# Altium project PreCharge.PrjPcb (part 4 of 4)

## Sheet Motor Interface - Pre-Charge Logic.SchDoc: Motor Interface - PreCharge Logic
size B; Organization: Midnight Sun Solar Rayce Car Team; Address1: University of Waterloo; Address2: 200 University Ave W; Address3: Waterloo, ON, Canada; Address4: N2L 3E9; DocumentNumber: 6; SheetNumber: 6; SheetTotal: 6; Website: www.uwmidsun.com; ProjectName: ProjectName
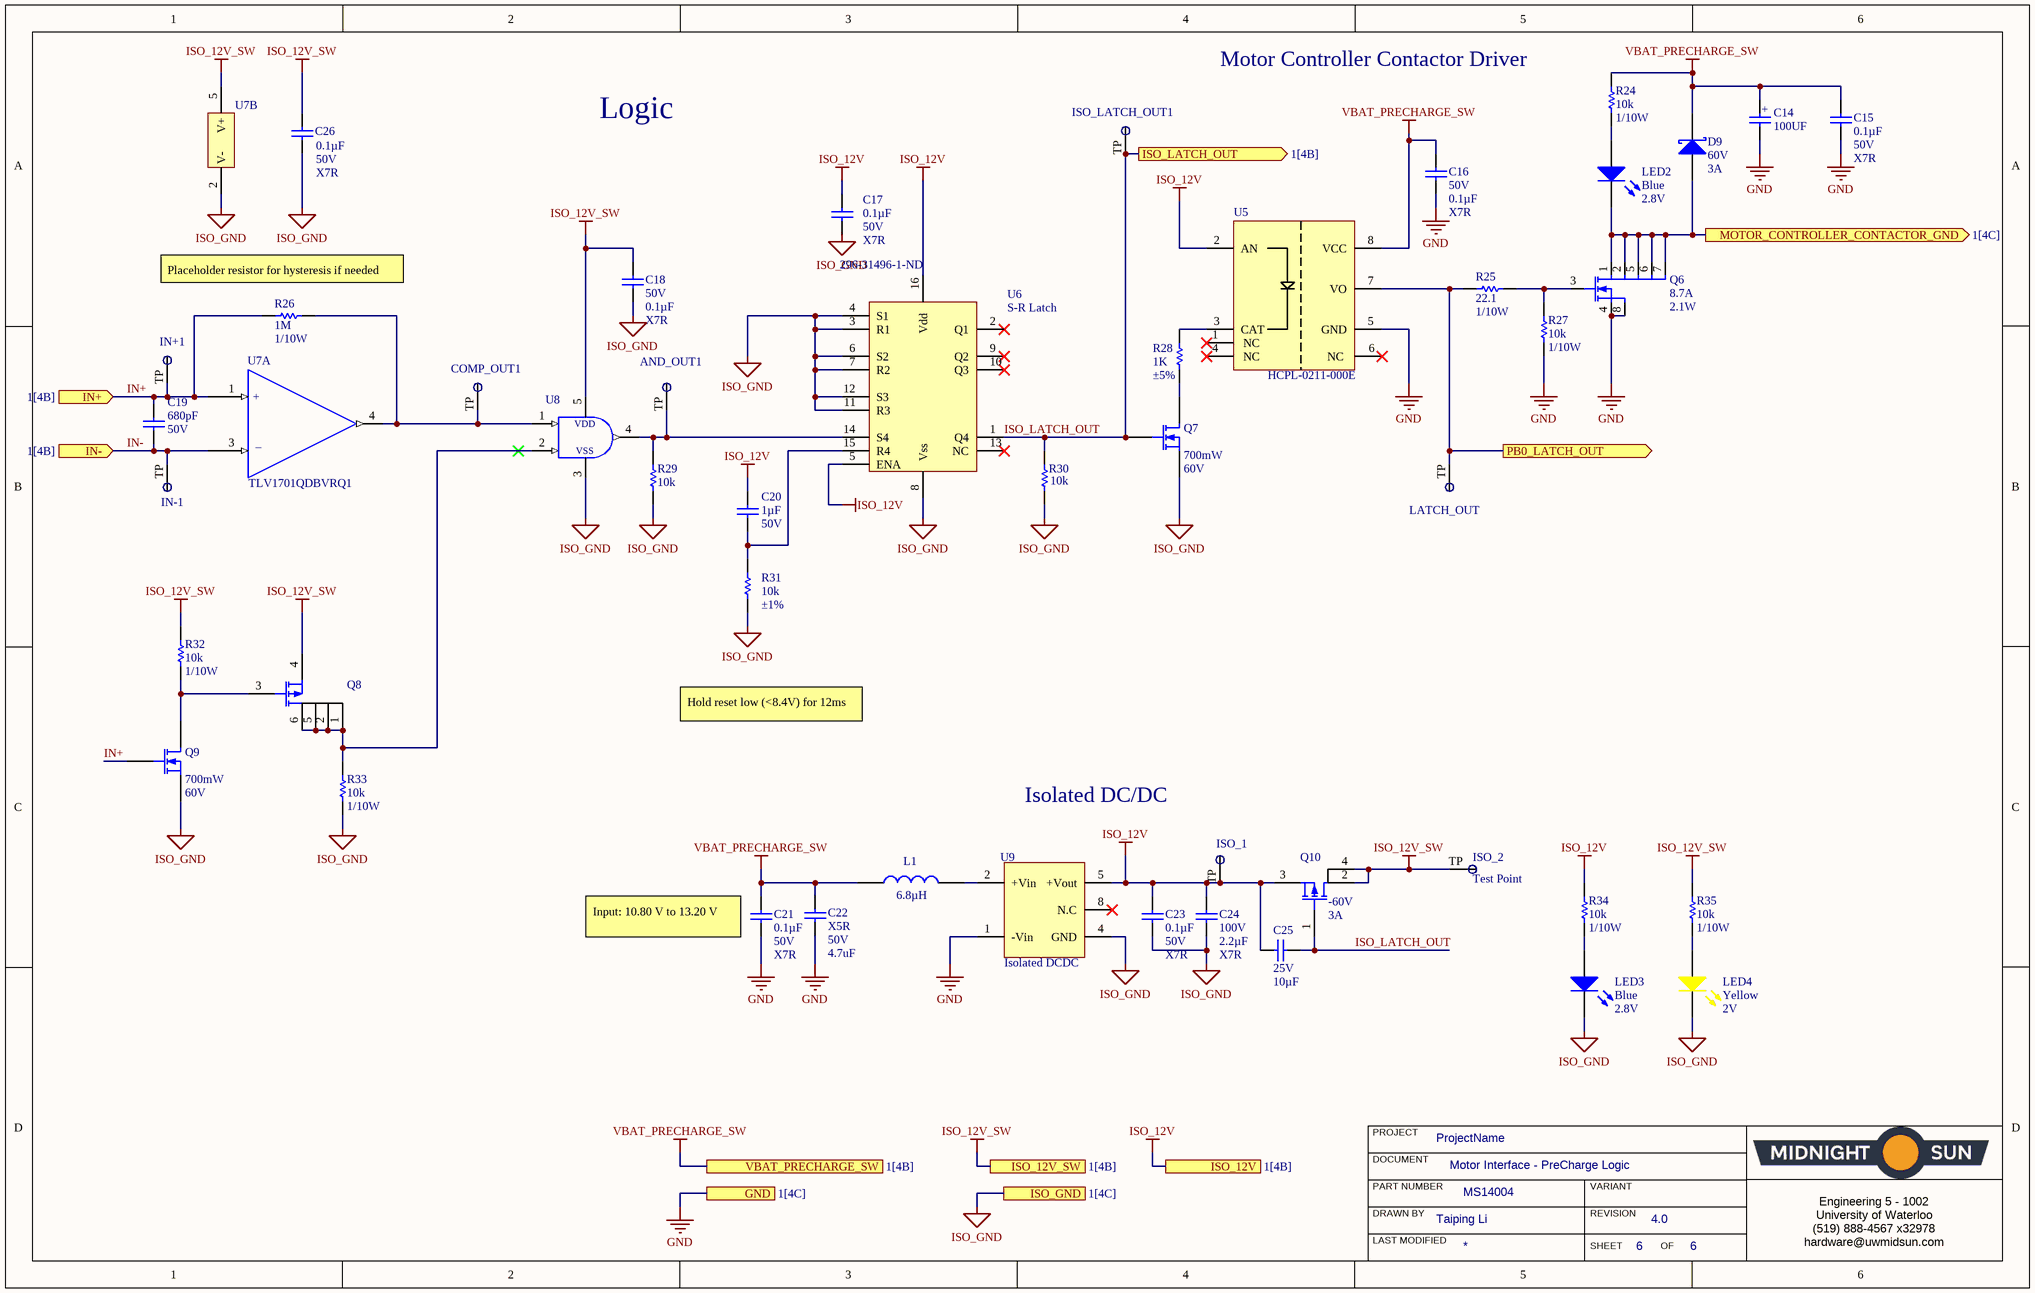
[diagram p5: Motor Interface - Pre-Charge Logic.SchDoc]

### Parts
AND_OUT1  Test Point  [Test Point]  (value not drawn)  (no BOM)
C14  100UF  [CAP ALUM 6.3MM RADIAL SMD]
C15  Capacitance: 0.1µF  Voltage: 50V  Temperature Coefficient: X7R  [CAP, 0603]  (hidden comment: CAP CER 0.1UF 50V 10% X7R 0603)
C16  Voltage: 50V  Capacitance: 0.1µF  Temperature Coefficient: X7R  [CAP, 0603]  (hidden comment: CAP CER 0.1UF 50V 10% X7R 0603)
C17  Voltage: 50V  Capacitance: 0.1µF  Temperature Coefficient: X7R  [CAP, 0603]  (hidden comment: CAP CER 0.1UF 50V 10% X7R 0603)
C18  Voltage: 50V  Capacitance: 0.1µF  Temperature Coefficient: X7R  [CAP, 0603]  (hidden comment: CAP CER 0.1UF 50V 10% X7R 0603)
C19  Voltage: 50V  Capacitance: 680pF  [CAP, 0603]  (hidden comment: CAP CER 680PF 50V C0G/NP0 0603)
C20  Voltage: 50V  Capacitance: 1µF  [CAP, 0603]  (hidden comment: CAP CER 1UF 50V 10% X7R 0603)
C21  Capacitance: 0.1µF  Voltage: 50V  Temperature Coefficient: X7R  [CAP, 0603]  (hidden comment: CAP CER 0.1UF 50V 10% X7R 0603)
C22  value 4.7uF  Temperature Coefficient: X5R  Voltage - Rated: 50V  [CAP, 0805]  (hidden comment: CAP CER 4.7UF 50V 10% X5R 0805)
C23  Capacitance: 0.1µF  Voltage: 50V  Temperature Coefficient: X7R  [CAP, 0603]  (hidden comment: CAP CER 0.1UF 50V 10% X7R 0603)
C24  Voltage: 100V  Capacitance: 2.2µF  Temperature Coefficient: X7R  [CAP, 1206]  (hidden comment: CAP CER 2.2UF 100V ±20% X7R 1206)
C25  Voltage - Rated: 25V  Capacitance: 10µF  [CAP, 0805]  (hidden comment: CAP CER 10uF 25V 10% X5R 0805)
C26  Voltage: 50V  Capacitance: 0.1µF  Temperature Coefficient: X7R  [CAP, 0603]  (hidden comment: CAP CER 0.1UF 50V 10% X7R 0603)
COMP_OUT1  Test Point  [Test Point]  (value not drawn)  (no BOM)
D9  Voltage - DC Reverse (Vr) (Max): 60V  Current - Average Rectified (Io): 3A  [Diode, SMA]  (hidden comment: DIODE SCHOTTKY 60V 3A SMA)
IN+1  Test Point  [Test Point]  (value not drawn)  (no BOM)
IN-1  Test Point  [Test Point]  (value not drawn)  (no BOM)
ISO_1  Test Point  [Test Point]  (value not drawn)  (no BOM)
ISO_2  Test Point  [Test Point]  (no BOM)
ISO_LATCH_OUT1  Test Point  [Test Point]  (value not drawn)  (no BOM)
L1  Inductance: 6.8µH  [NLFV32T-6R8M-EF/IND 6.8uH]  (hidden comment: IND 6.8uH 260mA 20% 1210)
LATCH_OUT  Test Point  [Test Point]  (value not drawn)  (no BOM)
LED2  Color: Blue  Voltage - Forward (Vf) (Typ): 2.8V  [LED_0603]  (hidden comment: LED BLUE CLEAR 2.8V 0603)
LED3  Color: Blue  Voltage - Forward (Vf) (Typ): 2.8V  [LED_0603]  (hidden comment: LED BLUE CLEAR 2.8V 0603)
LED4  Color: Yellow  Voltage - Forward (Vf) (Typ): 2V  [LED_0603]  (hidden comment: LED YELLOW CLEAR 2.1V 0603)
Q6  Current - Continuous Drain (Id) @ 25°C: 8.7A  Power Dissipation (Max): 2.1W  [MOSFET N-CH 30V 12A 2mmx2mm PQFN]  (hidden comment: MOSFET N-CH 30V 8.7A 2.1W 6-PQFN (2x2))
Q7  Max Power Dissipation: 700mW  Drain to Source Voltage (Vdss): 60V  [SOT23]  (hidden comment: MOSFET N-CH 60V 310MA SOT23)
Q8  MOSFET P-CH 30V 4A 1.6W SOT-23-6  [P-MOSFET]  (value not drawn)
Q9  Max Power Dissipation: 700mW  Drain to Source Voltage (Vdss): 60V  [SOT23]  (hidden comment: MOSFET N-CH 60V 310MA SOT23)
Q10  Continuous Drain Current (ID): 3A  Drain to Source Breakdown Voltage: -60V  [SOT223_N]  (hidden comment: P-Channel)
R24  Resistance: 10k  Power: 1/10W  [RES, 0603]  (hidden comment: RES 10K OHM 1% 1/10W 0603)
R25  Resistance: 22.1  Power: 1/10W  [RES, 0603]  (hidden comment: RES 22.1 OHM 1% 1/10W 0603)
R26  Resistance (Ohms): 1M  Power (Watts): 1/10W  [RES, 0603]  (hidden comment: RES 1M OHM 1% 1/10W 0603)
R27  Resistance: 10k  Power: 1/10W  [RES, 0603]  (hidden comment: RES 10K OHM 1% 1/10W 0603)
R28  1K  Tolerance: ±5%  [RES, 0603]
R29  Resistance: 10k  [RES, 0603]  (hidden comment: RES 10K OHM 1% 1/10W 0603)
R30  Resistance: 10k  [RES, 0603]  (hidden comment: RES 10K OHM 1% 1/10W 0603)
R31  Tolerance: ±1%  Resistance: 10k  [RES, 0603]  (hidden comment: RES 10K OHM 1% 1/10W 0603)
R32  Resistance: 10k  Power: 1/10W  [RES, 0603]  (hidden comment: RES 10K OHM 1% 1/10W 0603)
R33  Resistance: 10k  Power: 1/10W  [RES, 0603]  (hidden comment: RES 10K OHM 1% 1/10W 0603)
R34  Resistance: 10k  Power: 1/10W  [RES, 0603]  (hidden comment: RES 10K OHM 1% 1/10W 0603)
R35  Resistance: 10k  Power: 1/10W  [RES, 0603]  (hidden comment: RES 10K OHM 1% 1/10W 0603)
U5  Manufacturer Part Number: HCPL-0211-000E  [IC OPTOISOLATOR HCPL-0211 SO-8]  (hidden comment: IC OPTOISOLATOR 3.75KV PUSH PULL 8-SOIC)
U6  Supplier Part Number 1: 296-31496-1-ND  Logic Type: S-R Latch  [IC, SR Latch, CD4043BDR]  (hidden comment: IC SR LATCH 4CH 16SOIC)
U7  Manufacturer Part Number: TLV1701QDBVRQ1  [SOT95P280X145-5N]  (hidden comment: IC COMPARATOR TLV1701 SOT-23-5)  (parts A,B of 2)
U8  IC AND GATE 1CH 5-SSOP  [IC, 2-Input AND Gate]  (value not drawn)
U9  Type: Isolated DCDC  [IC, Isolated DCDC]  (hidden comment: IC DCDC ISOLATED 12V 1W 8-SMD 5-LEAD)

### Ports
GND (see 1[4C]), IN+ (in, see 1[4B]), IN- (in, see 1[4B]), ISO_12V (see 1[4B]), ISO_12V_SW (see 1[4B]), ISO_GND (see 1[4C]), ISO_LATCH_OUT (out, see 1[4B]), MOTOR_CONTROLLER_CONTACTOR_GND (out, see 1[4C]), PB0_LATCH_OUT (out), VBAT_PRECHARGE_SW (see 1[4B])

### Nets
GND: C14.2 C15.2 C16.2 C21.2 C22.1 Q6.4(S) Q6.8(S) R27.2 U5.5(GND) U9.1(-Vin) ; port GND
ISO_12V: C17.2 C20.1 C23.1 C24.2 C25.1 ISO_1.TP Q10.3(S) R34.2 U5.2(AN) U6.5(ENA) U6.16(Vdd) U9.5(+Vout) ; port ISO_12V
ISO_12V_SW: C18.2 C26.2 ISO_2.TP Q8.4(S) Q10.2(D) Q10.4(D) R32.1 R35.2 U7.5(V+) U8.5(VCC) ; port ISO_12V_SW
ISO_GND: C17.1 C18.1 C23.2 C24.1 C26.1 LED3.2(K) LED4.2(K) Q7.2(S) Q9.2(S) R29.1 R30.1 R31.2 R33.2 U6.3(R1) U6.4(S1) U6.6(S2) U6.7(R2) U6.8(Vss) U6.11(R3) U6.12(S3) U7.2(V-) U8.3(GND) U9.4(GND) ; port ISO_GND
VBAT_PRECHARGE_SW: C14.1 C15.1 C16.1 C21.1 C22.2 D9.2 L1.1 R24.2 U5.8(VCC) ; port VBAT_PRECHARGE_SW
IN+: C19.1 IN+1.TP Q9.3(G) R26.1 U7.1(+IN) ; port IN+
IN-: C19.2 IN-1.TP U7.3(-IN) ; port IN-
ISO_LATCH_OUT: C25.2 ISO_LATCH_OUT1.TP Q7.3(G) Q10.1(G) R30.2 U6.1(Q4) ; port ISO_LATCH_OUT
MOTOR_CONTROLLER_CONTACTOR_GND: D9.1 LED2.2(K) Q6.1(D) Q6.2(D) Q6.5(D) Q6.6(D) Q6.7(D) ; port MOTOR_CONTROLLER_CONTACTOR_GND
PB0: LATCH_OUT.TP R25.1 U5.7(VO) ; port PB0_LATCH_OUT
NetAND_OUT1_TP: AND_OUT1.TP R29.2 U6.14(S4) U8.4(Y)
NetC20_2: C20.2 R31.1 U6.15(R4)
NetCOMP_OUT1_TP: COMP_OUT1.TP R26.2 U7.4(OUT) U8.1(A)
NetL1_2: L1.2 U9.2(+Vin)
NetLED2_1: LED2.1(A) R24.1
NetLED3_1: LED3.1(A) R34.1
NetLED4_1: LED4.1(A) R35.1
NetQ6_3: Q6.3(G) R25.2 R27.1
NetQ7_1: Q7.1(D) R28.1
NetQ8_1: Q8.1(D) Q8.2(D) Q8.5(D) Q8.6(D) R33.1 U8.2(B)
NetQ8_3: Q8.3(G) Q9.1(D) R32.2
NetR28_2: R28.2 U5.3(CAT)

Not connected (* = marked no-connect by the designer): U5 1(NC)* 4(NC)* 6(NC)*; U6 2(Q1)* 9(Q2)* 10(Q3)* 13(NC)*; U9 8(N.C)*

### Notes on the sheet
- (near R24) Motor Controller Contactor Driver
- Logic
- (near R26) Placeholder resistor for hysteresis if needed
- Hold reset low (<8.4V) for 12ms
- Isolated DC/DC
- (near C21) Input: 10.80 V to 13.20 V
- PROJECT
- DOCUMENT
- DRAWN BY
- LAST MODIFIED
- PART NUMBER
- REVISION
- SHEET
- VARIANT
- OF
- Engineering 5 - 1002
  University of Waterloo
  (519) 888-4567 x32978
  hardware@uwmidsun.com
- (in symbol CAP ALUM 100UF 20% 35V SMD) +
- (in symbol IC AND GATE 1CH 5-SSOP) VDD; VSS
- (in symbol IC COMPARATOR TLV1701 SOT-23-5, part A) +; _

### Library data of the parts
C14 = CAP ALUM 100UF 20% 35V SMD: 100µF 35V Aluminum Electrolytic Capacitors Radial, Can - SMD 2000 Hrs @ 85°C; Manufacturer 1: Panasonic; Manufacturer Part Number 1: EEE-1VA101XP; Description 1: Cap Aluminum Lytic 100uF 35V 20% (6.3 X 7.7mm) SMD 132mA 2000h 85C Automotive T/R; Tolerance: 20%; Ripple Current: 132mA; Polarity: Polar; Life (Hours): 2000Hour; Leakage Current: 3uA; Supplier 1: Digi-Key; Supplier Part Number 1: PCE3951CT-ND; Stock 1: 170823; Pricing 1: 1=0.44, 10=0.304, 100=0.1822 (USD); Mount: Surface Mount,PCB; Case/Package: Radial; Number of Pins: 8; Contact Plating: Tin; Min Operating Temperature: -40°C; Max Operating Temperature: 85°C; Capacitance: 100uF; Voltage Rating: 35V; Packaging: Tape and Reel; Package Quantity: 900; Ripple Current (AC): 132mA; Voltage Rating (DC): 35V; Termination: SMD/SMT; Voltage: 35V; Diameter: 6.3mm; Length: 8mm; Height: 7.7mm; Height - Seated (Max): 0.303inch; Radiation Hardening: No; REACH SVHC: No SVHC; Lead Free: Lead Free; ComponentLink1URL: https://datasheet.ciiva.com/46378/aba0000ce2-46378341.pdf; ComponentLink1Description: https://datasheet.ciiva.com/46378/aba0000ce2-46378341.pdf; ComponentLink2URL: https://datasheet.ciiva.com/17535/aba0000ce2-17535510.pdf; ComponentLink2Description: https://datasheet.ciiva.com/17535/aba0000ce2-17535510.pdf; ComponentLink3URL: https://datasheet.ciiva.com/30170/11aba0000ce2-30170103.pdf; ComponentLink3Description: https://datasheet.ciiva.com/30170/11aba0000ce2-30170103.pdf; ComponentLink4URL: https://datasheet.ciiva.com/31414/aba0000ce2-31414696.pdf; ComponentLink4Description: https://datasheet.ciiva.com/31414/aba0000ce2-31414696.pdf; ComponentLink5URL: https://datasheet.ciiva.com/24068/aba0000ce2-40801-24068089.pdf; ComponentLink5Description: https://datasheet.ciiva.com/24068/aba0000ce2-40801-24068089.pdf; ComponentLink6URL: https://datasheet.ciiva.com/14591/70255710-14591771.pdf; ComponentLink6Description: https://datasheet.ciiva.com/14591/70255710-14591771.pdf; ComponentLink7URL: https://datasheet.ciiva.com/14600/70255710-14600731.pdf; ComponentLink7Description: https://datasheet.ciiva.com/14600/70255710-14600731.pdf; ComponentLink8URL: https://datasheet.ciiva.com/46374/aba0000ce2-46374427.pdf; ComponentLink8Description: https://datasheet.ciiva.com/46374/aba0000ce2-46374427.pdf; ComponentLink9URL: https://datasheet.ciiva.com/11673/aba0000ce2-11673887.pdf; ComponentLink9Description: https://datasheet.ciiva.com/11673/aba0000ce2-11673887.pdf
C15-C18 C21 C23 C26 = CAP CER 0.1UF 50V 10% X7R 0603: 0.10µF ±10% 50V Ceramic Capacitor X7R 0603 (1608 Metric); Manufacturer 1: AVX Corporation; Manufacturer Part Number 1: 06035C104KAT2A; Supplier 1: Digi-Key; Supplier Part Number 1: 478-5052-1-ND; Packaging: Cut Tape (CT); Part Status: Active; Operating Temperature: -55°C ~ 125°C; Ratings: -; Mounting Type: Surface Mount, MLCC; Package / Case: 0603 (1608 Metric); Size / Dimension: 0.063" L x 0.032" W (1.60mm x 0.81mm); Height - Seated (Max): -; Thickness (Max): 0.035" (0.90mm); Lead Spacing: -; Lead Style: -; ComponentLink1URL: http://datasheets.avx.com/X7RDielectric.pdf; ComponentLink1Description: http://datasheets.avx.com/X7RDielectric.pdf; Tolerance: ±10%
C19 = CAP CER 680PF 50V C0G 0603: 680pF ±5% 50V Ceramic Capacitor C0G, NP0 0603 (1608 Metric); Manufacturer: Samsung; Manufacturer Part Number: CL10C681JB8NNNC; Temperature Coefficient: 300ppm/°C; Supplier 1: Digi-Key; Stock 1: 40000; Pricing 1: 1=0.16, 10=0.112, 100=0.0526, 500=0.0369, 1000=0.03055 (USD); Mount: Surface Mount; Case/Package: 0603; Case Code (Metric): 1608; Case Code (Imperial): 0603; Min Operating Temperature: -55°C; Max Operating Temperature: 125°C; Tolerance: 5%; Packaging: Tape and Reel; Voltage Rating: 50V; Voltage Rating (DC): 50V; Length: 1.6mm; Height: 0.8mm; Width: 0.031inch; Thickness: 0.035inch; Depth: 0.8mm; Radiation Hardening: No; ComponentLink1URL: http://www.samsungsem.com/kr/support/product-search/mlcc/CL10C681JB8NNNC.jsp; ComponentLink1Description: http://www.samsungsem.com/kr/support/product-search/mlcc/CL10C681JB8NNNC.jsp; ComponentLink2URL: https://www.verical.com/server-webapp/html/getDatasheet?partID=359565; ComponentLink2Description: https://www.verical.com/server-webapp/html/getDatasheet?partID=359565; ComponentLink3URL: http://www1.futureelectronics.com/doc/SAMSUNG%20PASSIVE/CL05B104KQ5NNNC.pdf; ComponentLink3Description: http://www1.futureelectronics.com/doc/SAMSUNG%20PASSIVE/CL05B104KQ5NNNC.pdf; ComponentLink4URL: http://www.rapidonline.com/pdf/71-0310.pdf; ComponentLink4Description: http://www.rapidonline.com/pdf/71-0310.pdf; ComponentLink5URL: https://www.distrelec.biz/Web/Downloads/_e/ng/MLCC_CatalogDownload2013_ENG.pdf?mime=application%2Fpdf; ComponentLink5Description: https://www.distrelec.biz/Web/Downloads/_e/ng/MLCC_CatalogDownload2013_ENG.pdf?mime=application%2Fpdf; ComponentLink6URL: https://produktinfo.conrad.com/datenblaetter/450000-474999/456146-da-01-en-VS_KONDENSATOR_0603.pdf; ComponentLink6Description: https://produktinfo.conrad.com/datenblaetter/450000-474999/456146-da-01-en-VS_KONDENSATOR_0603.pdf; Supplier Part Number 1: 1276-1820-1-ND; Dielectric: C0G; Material: Ceramic; Lead Free: Lead Free
C20 = CAP CER 1UF 50V 10% X7R 0603: 1µF ±10% 50V Ceramic Capacitor X7R 0603 (1608 Metric); Manufacturer 1: Taiyo Yuden; Manufacturer Part Number 1: UMK107AB7105KA-T; Supplier 1: Digi-Key; Supplier Part Number 1: 587-3247-1-ND; Packaging: Cut Tape (CT); Part Status: Active; Operating Temperature: -55°C ~ 125°C; Ratings: -; Mounting Type: Surface Mount, MLCC; Package / Case: 0603 (1608 Metric); Size / Dimension: 0.063" L x 0.031" W (1.60mm x 0.80mm); Height - Seated (Max): -; Thickness (Max): 0.037" (0.95mm); Lead Spacing: -; Lead Style: -; ComponentLink1URL: http://www.yuden.co.jp/productdata/catalog/en/mlcc_all_e.pdf; ComponentLink1Description: http://www.yuden.co.jp/productdata/catalog/en/mlcc_all_e.pdf; Tolerance: ±10%; Temperature Coefficient: X7R
C22 = CAP CER 4.7UF 50V 10% X5R 0805: 4.7µF ±20% 50V Ceramic Capacitor X5R 0805 (2012 Metric); Manufacturer 1: Murata Electronics North America; Manufacturer Part Number 1: GRT21BR61H475ME13L; Description 1: CAP CER 4.7UF 50V X5R 0805; Supplier 1: Digi-Key; Supplier Part Number 1: 490-12395-1-ND; Packaging: Cut Tape (CT); Part Status: Active; Operating Temperature: -55°C ~ 85°C; Ratings: AEC-Q200; Mounting Type: Surface Mount, MLCC; Package / Case: 0805 (2012 Metric); Size / Dimension: 0.079" L x 0.049" W (2.00mm x 1.25mm); Height - Seated (Max): -; Thickness (Max): 0.057" (1.45mm); Lead Spacing: -; Lead Style: -; ComponentLink1URL: http://search.murata.co.jp/Ceramy/image/img/A01X/G101/ENG/GRT21BR61H475ME13-01.pdf; ComponentLink1Description: http://search.murata.co.jp/Ceramy/image/img/A01X/G101/ENG/GRT21BR61H475ME13-01.pdf; Tolerance: ±20%; RoHS: RoHS Compliant; Category: Capacitors; Stock 1: 4286; Pricing 1: 1=0.56, 10=0.389, 100=0.2338, 500=0.17536, 1000=0.14808 (CAD); Features: -; Applications: Automotive
C24 = CAP CER 2.2UF 100V ±20% X7R 1206: 2.2µF ±20% 100V Ceramic Capacitor X7R 1206 (3216 Metric); Manufacturer 1: Murata Electronics North America; Manufacturer Part Number 1: GRM31CR72A225MA73L; Supplier 1: Digi-Key; Supplier Part Number 1: 490-12773-1-ND; Packaging: Cut Tape (CT); Part Status: Active; Operating Temperature: -55°C ~ 125°C; Ratings: -; Mounting Type: Surface Mount, MLCC; Package / Case: 1206 (3216 Metric); Size / Dimension: 0.126" L x 0.063" W (3.20mm x 1.60mm); Height - Seated (Max): -; Thickness (Max): 0.071" (1.80mm); Lead Spacing: -; Lead Style: -; ComponentLink1URL: http://www.murata.com/~/media/webrenewal/support/library/catalog/products/capacitor/mlcc/c02e.ashx; ComponentLink1Description: http://www.murata.com/~/media/webrenewal/support/library/catalog/products/capacitor/mlcc/c02e.ashx; Tolerance: ±20%
C25 = CAP CER 10uF 25V 10% X5R 0805: 10µF ±10% 25V Ceramic Capacitor X5R 0805 (2012 Metric); Manufacturer: Murata Electronics North America; Manufacturer Part Number: GRM21BR61E106KA73L; Supplier 1: Digi-Key; RoHS: RoHS Compliant; Category: Capacitors; Stock 1: 1695157; Packaging: Cut Tape (CT); Part Status: Active; Tolerance: ±10%; Temperature Coefficient: X5R; Operating Temperature: -55°C ~ 85°C; Features: -; Ratings: -; Applications: General Purpose; Mounting Type: Surface Mount, MLCC; Package / Case: 0805 (2012 Metric); Size / Dimension: 0.079" L x 0.049" W (2.00mm x 1.25mm); Height - Seated (Max): -; Thickness (Max): 0.053" (1.35mm); Lead Spacing: -; Lead Style: -; ComponentLink1URL: http://search.murata.co.jp/Ceramy/image/img/A01X/G101/ENG/GRM21BR61E106KA73-01.pdf; ComponentLink1Description: http://search.murata.co.jp/Ceramy/image/img/A01X/G101/ENG/GRM21BR61E106KA73-01.pdf; Supplier Part Number 1: 490-5523-1-ND; Pricing 1: 1=0.3, 10=0.214, 100=0.1008, 500=0.07068, 1000=0.05851 (CAD)
D9 = DIODE SCHOTTKY 60V 3A SMA: Diode Schottky 60V 3A Surface Mount SMA; Manufacturer 1: Diodes Incorporated; Manufacturer Part Number 1: B360A-13-F; Voltage - Forward (Vf) (Max) @ If: 700mV @ 3A; Speed: Fast Recovery =< 500ns, > 200mA (Io); Current - Reverse Leakage @ Vr: 500µA @ 60V; Capacitance @ Vr, F: 200pF @ 4V, 1MHz; Supplier 1: Digi-Key; Supplier Part Number 1: B360A-FDICT-ND; Packaging: Cut Tape (CT); Part Status: Active; Diode Type: Schottky; Mounting Type: Surface Mount; Package / Case: DO-214AC, SMA; Supplier Device Package: SMA; Operating Temperature - Junction: -55°C ~ 150°C; ComponentLink1URL: https://www.diodes.com/assets/Datasheets/ds30891.pdf; ComponentLink1Description: https://www.diodes.com/assets/Datasheets/ds30891.pdf
L1 = IND 6.8uH 260mA 20% 1210: 6.8µH Shielded Wirewound Inductor 260mA 204 mOhm Max 1210 (3225 Metric); Manufacturer 1: TDK Corporation; Manufacturer Part Number 1: NLFV32T-6R8M-EF; Material - Core: Ferrite; Supplier 1: Digi-Key; Supplier Part Number 1: 445-15776-1-ND; Current Rating: 260mA; DC Resistance (DCR): 204 mOhm Max; Packaging: Cut Tape (CT); Part Status: Active; Type: Wirewound; Current - Saturation: -; Shielding: Shielded; Q @ Freq: -; Frequency - Self Resonant: -; Ratings: -; Operating Temperature: -40°C ~ 105°C; Mounting Type: Surface Mount; Package / Case: 1210 (3225 Metric); Supplier Device Package: 1210 (3225 Metric); Size / Dimension: 0.126" L x 0.098" W (3.20mm x 2.50mm); Height - Seated (Max): 0.094" (2.40mm); ComponentLink1URL: https://product.tdk.com/info/en/catalog/datasheets/inductor_commercial_decoupling_nlfv32-ef_en.pdf; ComponentLink1Description: https://product.tdk.com/info/en/catalog/datasheets/inductor_commercial_decoupling_nlfv32-ef_en.pdf; Tolerance: ±20%
LED2 LED3 = LED BLUE CLEAR 2.8V 0603: Blue 470nm LED Indication - Discrete 2.8V 0603 (1608 Metric); Manufacturer 1: Lite-On Inc.; Manufacturer Part Number 1: LTST-C193TBKT-5A; Lens Color: Colorless; Millicandela Rating: 15mcd; Lens Style/Size: Rectangle with Flat Top, 1.15mm x 0.80mm; Current - Test: 5mA; Viewing Angle: 130°; Wavelength - Peak: 468nm; Supplier 1: Digi-Key; Supplier Part Number 1: 160-1827-1-ND; Packaging: Cut Tape (CT); Part Status: Active; Lens Transparency: Clear; Mounting Type: Surface Mount; Wavelength - Dominant: 470nm; Package / Case: 0603 (1608 Metric); Supplier Device Package: Chip LED; Size / Dimension: 1.60mm L x 0.80mm W; Height (Max): 0.45mm; ComponentLink1URL: http://optoelectronics.liteon.com/upload/download/DS22-2004-060/P_100_LTST-C193TBKT-5A.pdf; ComponentLink1Description: http://optoelectronics.liteon.com/upload/download/DS22-2004-060/P_100_LTST-C193TBKT-5A.pdf
LED4 = LED YELLOW CLEAR 2.1V 0603: Yellow 590nm LED Indication - Discrete 2V 0603 (1608 Metric); Manufacturer: Wurth Electronics Inc.; Manufacturer Part Number: 150060YS75000; Lens Color: Colorless; Millicandela Rating: 120mcd; Lens Style/Size: Rectangle with Flat Top, 1.10mm x 0.70mm; Current - Test: 20mA; Viewing Angle: 140°; Wavelength - Peak: 595nm; Supplier 1: Digi-Key; RoHS: RoHS Compliant; Category: Optoelectronics; Stock 1: 10523; Pricing 1: 1=0.21, 100=0.1617, 500=0.13964 (CAD); Packaging: Cut Tape (CT); Part Status: Active; Lens Transparency: Clear; Mounting Type: Surface Mount; Wavelength - Dominant: 590nm; Features: -; Package / Case: 0603 (1608 Metric); Supplier Device Package: 0603; Size / Dimension: 1.60mm L x 0.80mm W; Height (Max): 0.80mm; ComponentLink1URL: http://katalog.we-online.de/led/datasheet/150060YS75000.pdf; ComponentLink1Description: http://katalog.we-online.de/led/datasheet/150060YS75000.pdf; Supplier Part Number 1: 732-4981-1-ND
Q6 = MOSFET N-CH 30V 8.7A 2.1W 6-PQFN (2x2): Manufacturer 1: Infineon Technologies; Manufacturer Part Number 1: IRLHS6342TRPBF; Description 1: MOSFET N-CH 30V 8.7A 2X2 PQFN; FET Type: N-Channel; Drive Voltage (Max Rds On,  Min Rds On): 2.5V, 4.5V; Vgs(th) (Max) @ Id: 1.1V @ 10µA; Gate Charge (Qg) (Max) @ Vgs: 11nC @ 4.5V; Input Capacitance (Ciss) (Max) @ Vds: 1019pF @ 25V; Vgs (Max): ±12V; Rds On (Max) @ Id, Vgs: 15.5 mOhm @ 8.5A, 4.5V; Supplier 1: Digi-Key; Supplier Part Number 1: IRLHS6342TRPBFCT-ND; RoHS: RoHS Compliant; Category: Discrete Semiconductor Products; Stock 1: 9984; Pricing 1: 1=0.79, 10=0.685, 100=0.5118, 500=0.4022, 1000=0.31079 (CAD); Packaging: Cut Tape (CT); Part Status: Active; Technology: MOSFET (Metal Oxide); Drain to Source Voltage (Vdss): 30V; FET Feature: -; Operating Temperature: -55°C ~ 150°C (TJ); Mounting Type: Surface Mount; Supplier Device Package: 6-PQFN (2x2); Package / Case: 6-PowerVDFN; ComponentLink1URL: http://www.infineon.com/dgdl/irlhs6342pbf.pdf?fileId=5546d462533600a401535663b52625ad; ComponentLink1Description: http://www.infineon.com/dgdl/irlhs6342pbf.pdf?fileId=5546d462533600a401535663b52625ad
Q7 Q9 = MOSFET N-CH 60V 310MA SOT23: N-Channel 60V 310mA (Ta) 370mW (Ta) Surface Mount SOT-23; Manufacturer: Diodes; Manufacturer Part Number: DMN6140L-7; Rds On Max: 140mR; Input Capacitance: 315pF; Continuous Drain Current (ID): 1.6A; Threshold Voltage: 3V; Element Configuration: Single; Number of Channels: 1; Gate to Source Voltage (Vgs): 20V; Fall Time: 2.7ns; Rise Time: 3.6ns; Turn-Off Delay Time: 16.3ns; Turn-On Delay Time: 2.6ns; Power Dissipation: 540mW; FET Type: 1 N-Channel; Supplier 1: Digi-Key; Stock 1: 0; Mount: Surface Mount; Case/Package: TO-236-3; Number of Pins: 3; Weight: 0.000282oz; Min Operating Temperature: -55°C; Max Operating Temperature: 150°C; Package Quantity: 3000; Packaging: Tape and Reel; Drain to Source Resistance: 140mR; REACH SVHC: No SVHC; Lead Free: Lead Free; ComponentLink1URL: https://datasheet.ciiva.com/29747/dmn6140l-29747654.pdf; ComponentLink1Description: https://datasheet.ciiva.com/29747/dmn6140l-29747654.pdf; ComponentLink2URL: https://datasheet.ciiva.com/29747/dmn6140l-29747660.pdf; ComponentLink2Description: https://datasheet.ciiva.com/29747/dmn6140l-29747660.pdf; Supplier Part Number 1: DMN65D8L-7DICT-ND; Drain to Source Breakdown Voltage: 60V; Number of Elements: 1; Length: 3mm; Height: 1.1mm; Width: 1.4mm; ComponentLink3URL: https://datasheet.ciiva.com/6371/dmn65d8l-6371124.pdf; ComponentLink3Description: https://datasheet.ciiva.com/6371/dmn65d8l-6371124.pdf; ComponentLink4URL: https://datasheet.ciiva.com/6371/dmn65d8l-6371126.pdf; ComponentLink4Description: https://datasheet.ciiva.com/6371/dmn65d8l-6371126.pdf; ComponentLink5URL: https://datasheet.ciiva.com/13058/dmn65d8l-219098-13058455.pdf; ComponentLink5Description: https://datasheet.ciiva.com/13058/dmn65d8l-219098-13058455.pdf; ComponentLink6URL: https://datasheet.ciiva.com/6371/dmn65d8l-6371128.pdf; ComponentLink6Description: https://datasheet.ciiva.com/6371/dmn65d8l-6371128.pdf
Q8 = MOSFET P-CH 30V 4A 1.6W SOT-23-6: P-Channel 30V 4A (Ta) 1.6W (Ta) Surface Mount SOT-23-6; Manufacturer 1: STMicroelectronics; Manufacturer Part Number 1: STT4P3LLH6; Current - Continuous Drain (Id) @ 25°C: 4A (Ta); Drive Voltage (Max Rds On,  Min Rds On): 4.5V, 10V; Vgs(th) (Max) @ Id: 2.5V @ 250µA; Gate Charge (Qg) (Max) @ Vgs: 6nC @ 4.5V; Input Capacitance (Ciss) (Max) @ Vds: 639pF @ 25V; Vgs (Max): ±20V; Rds On (Max) @ Id, Vgs: 56 mOhm @ 2A, 10V; Supplier 1: Digi-Key; Supplier Part Number 1: 497-15521-1-ND; Packaging: Cut Tape (CT); Part Status: Active; FET Type: P-Channel; Technology: MOSFET (Metal Oxide); Drain to Source Voltage (Vdss): 30V; FET Feature: -; Power Dissipation (Max): 1.6W (Ta); Operating Temperature: 150°C (TJ); Mounting Type: Surface Mount; Supplier Device Package: SOT-23-6; Package / Case: SOT-23-6; ComponentLink1URL: http://www.st.com/content/ccc/resource/technical/document/datasheet/13/e4/a1/65/8b/79/44/73/DM00084060.pdf/files/DM00084060.pdf/jcr:content/translations/en.DM00084060.pdf; ComponentLink1Description: http://www.st.com/content/ccc/resource/technical/document/datasheet/13/e4/a1/65/8b/79/44/73/DM00084060.pdf/files/DM00084060.pdf/jcr:content/translations/en.DM00084060.pdf
Q10 = MOSFET P-CH 60V 3A SOT223: P-Channel 60V 3A (Ta) 2W (Ta) Surface Mount SOT-223; Manufacturer: Diodes; Manufacturer Part Number: ZXMP6A17GQTA; Rise Time: 3.4ns; Rds On Max: 125mR; Input Capacitance: 637pF; Turn-On Delay Time: 2.6ns; Turn-Off Delay Time: 26.2ns; Fall Time: 11.3ns; Gate to Source Voltage (Vgs): 20V; Element Configuration: Single; Number of Channels: 1; Drain to Source Resistance: 190mR; Supplier 1: Digi-Key; Stock 1: 815; Pricing 1: 1=0.9, 10=0.788, 100=0.6076, 500=0.45012 (USD); Mount: Surface Mount; Case/Package: TO-261-4; Number of Pins: 3; Weight: 0.000282oz; Min Operating Temperature: -55°C; Max Operating Temperature: 150°C; Package Quantity: 1; Packaging: Tape and Reel; Drain to Source Voltage (Vdss): 60V; Max Power Dissipation: 2W; Radiation Hardening: No; Lead Free: Lead Free; REACH SVHC: No SVHC; ComponentLink1URL: https://datasheet.ciiva.com/29747/zxmp6a17gq-29747441.pdf; ComponentLink1Description: https://datasheet.ciiva.com/29747/zxmp6a17gq-29747441.pdf; ComponentLink2URL: https://datasheet.ciiva.com/29747/zxmp6a17gq-29747434.pdf; ComponentLink2Description: https://datasheet.ciiva.com/29747/zxmp6a17gq-29747434.pdf; ComponentLink3URL: https://datasheet.ciiva.com/29747/zxmp6a17gq-29747438.pdf; ComponentLink3Description: https://datasheet.ciiva.com/29747/zxmp6a17gq-29747438.pdf; Supplier Part Number 1: ZXMP6A17GQTADIDKR-ND
R24 R27 R29-R35 = RES 10K OHM 1% 1/10W 0603: RES SMD 10K OHM 1% 1/10W 0603; Manufacturer 1: Yageo; Manufacturer Part Number 1: RC0603FR-0710KL; Temperature Coefficient: ±100ppm/°C; Supplier 1: Digi-Key; Supplier Part Number 1: 311-10.0KHRCT-ND; Packaging: Cut Tape (CT); Part Status: Active; Composition: Thick Film; Operating Temperature: -55°C ~ 155°C; Package / Case: 0603 (1608 Metric); Supplier Device Package: 0603; Size / Dimension: 0.063" L x 0.031" W (1.60mm x 0.80mm); Height - Seated (Max): 0.022" (0.55mm); Failure Rate: -; ComponentLink1URL: http://www.yageo.com/documents/recent/PYu-RC_Group_51_RoHS_L_7.pdf; ComponentLink1Description: http://www.yageo.com/documents/recent/PYu-RC_Group_51_RoHS_L_7.pdf
  R24 R27 R32-R35: Tolerance: ±1%
  R29: Tolerance: ±1%; Power: 1/10W
  R30: Power: 1/10W; Tolerance: ±1%
  R31: Power: 1/10W
R25 = RES 22.1 OHM 1% 1/10W 0603: 22.1 Ohm ±1% 0.1W, 1/10W Chip Resistor 0603 (1608 Metric) Moisture Resistant Thick Film; Manufacturer 1: Yageo; Manufacturer Part Number 1: RC0603FR-0722R1L; Temperature Coefficient: ±100ppm/°C; Supplier 1: Digi-Key; Supplier Part Number 1: 311-22.1HRCT-ND; Packaging: Cut Tape (CT); Part Status: Active; Composition: Thick Film; Operating Temperature: -55°C ~ 155°C; Package / Case: 0603 (1608 Metric); Supplier Device Package: 0603; Size / Dimension: 0.063" L x 0.031" W (1.60mm x 0.80mm); Height - Seated (Max): 0.022" (0.55mm); Failure Rate: -; ComponentLink1URL: http://www.yageo.com/documents/recent/PYu-RC_Group_51_RoHS_L_7.pdf; ComponentLink1Description: http://www.yageo.com/documents/recent/PYu-RC_Group_51_RoHS_L_7.pdf; Tolerance: ±1%
R26 = RES 1M OHM 1% 1/10W 0603: 1M Ohm ±1% 0.1W, 1/10W Chip Resistor 0603 (1608 Metric) Moisture Resistant Thick Film; Manufacturer 1: Yageo; Manufacturer Part Number 1: RC0603FR-071ML; Temperature Coefficient: ±100ppm/°C; Description 1: RES SMD 1M OHM 1% 1/10W 0603; Supplier 1: Digi-Key; Supplier Part Number 1: 311-1.00MHRCT-ND; Packaging: Cut Tape (CT); Part Status: Active; Composition: Thick Film; Operating Temperature: -55°C ~ 155°C; Package / Case: 0603 (1608 Metric); Supplier Device Package: 0603; Size / Dimension: 0.063" L x 0.031" W (1.60mm x 0.80mm); Height - Seated (Max): 0.022" (0.55mm); Failure Rate: -; ComponentLink1URL: http://www.yageo.com/documents/recent/PYu-RC_Group_51_RoHS_L_7.pdf; ComponentLink1Description: http://www.yageo.com/documents/recent/PYu-RC_Group_51_RoHS_L_7.pdf; Tolerance: ±1%; RoHS: RoHS Compliant; Category: Resistors; Stock 1: 2336711; Pricing 1: 1=0.16, 10=0.022, 100=0.0089, 1000=0.00402, 2500=0.00349 (CAD); Features: Moisture Resistant
R28 = RES 1K OHM 5% 1/10W 0603: 1k Ohm ±5% 0.1W, 1/10W Chip Resistor 0603 (1608 Metric); Manufacturer: Yageo; Manufacturer Part Number: RC0603JR-071KL; Temperature Coefficient: ±100ppm/°C; Supplier 1: Digi-Key; Supplier Part Number 1: 311-1.0KGRCT-ND; RoHS: RoHS Compliant; Category: Resistors; Stock 1: 4415240; Pricing 1: 1=0.15, 10=0.017, 100=0.0071, 1000=0.0032, 2500=0.00278 (CAD); Packaging: Cut Tape (CT); Part Status: Active; Resistance (Ohms): 1k; Power (Watts): 0.1W, 1/10W; Composition: Thick Film; Features: Moisture Resistant; Operating Temperature: -55°C ~ 155°C; Package / Case: 0603 (1608 Metric); Supplier Device Package: 0603; Size / Dimension: 0.063" L x 0.031" W (1.60mm x 0.80mm); Height - Seated (Max): 0.022" (0.55mm); Failure Rate: -; ComponentLink1URL: http://www.yageo.com/documents/recent/PYu-RC_Group_51_RoHS_L_7.pdf; ComponentLink1Description: http://www.yageo.com/documents/recent/PYu-RC_Group_51_RoHS_L_7.pdf
U5 = IC OPTOISOLATOR 3.75KV PUSH PULL 8-SOIC: Logic Output Optoisolator 5MBd Push-Pull, Totem Pole 3750Vrms 1 Channel 5kV/µs, 10kV/µs CMTI 8-SO Tall; Manufacturer: Broadcom Avago; Forward Voltage: 1.7V; Propagation Delay: 300ns; Number of Channels: 1; Output Current per Channel: 25mA; Forward Current: 10mA; Reverse Breakdown Voltage: 5V; Direction: Unidirectional; Max Power Dissipation: 210mW; Rise Time: 30ns; Fall Time: 7ns; Data Rate: 5Mbps; Input Current: 5mA; Min Supply Voltage: 4.5V; Max Supply Voltage: 20V; Approvals: CSA,UL,VDE; Supplier 1: Digi-Key; Supplier Part Number 1: 516-1625-5-ND; RoHS: Yes; Stock 1: 3605; Mount: Surface Mount,Through Hole; Case/Package: SOIC; Number of Pins: 8; Contact Plating: Matte,Tin; Min Operating Temperature: -40°C; Max Operating Temperature: 85°C; Packaging: Rail/Tube; Turn-On Delay Time: 300ns; Isolation Voltage: 3.75kV; Output Current: 25mA; Max Output Current: 25mA; Package Quantity: 100; Number of Elements: 1; Power Dissipation: 210mW; Max Input Current: 10mA; Max Output Voltage: 20V; Radiation Hardening: No; REACH SVHC: No SVHC; Lead Free: Lead Free; ComponentLink1URL: http://uk.rs-online.com/webdocs/0ad5/0900766b80ad5e24.pdf; ComponentLink1Description: http://uk.rs-online.com/webdocs/0ad5/0900766b80ad5e24.pdf; ComponentLink2URL: https://www.verical.com/server-webapp/html/getDatasheet?partID=117687; ComponentLink2Description: https://www.verical.com/server-webapp/html/getDatasheet?partID=117687; ComponentLink3URL: http://datasheet.iiic.cc/avago_technologies/HCPL-0211-000E.pdf; ComponentLink3Description: http://datasheet.iiic.cc/avago_technologies/HCPL-0211-000E.pdf; ComponentLink4URL: https://produktinfo.conrad.com/datenblaetter/125000-149999/140038-da-01-en-OPTOKOPPLER_HCPL_0211_000E.pdf; ComponentLink4Description: https://produktinfo.conrad.com/datenblaetter/125000-149999/140038-da-01-en-OPTOKOPPLER_HCPL_0211_000E.pdf
U6 = IC SR LATCH 4CH 16SOIC: S-R Latch 4 Channel 1:1 IC Tri-State 16-TSSOP; Manufacturer 1: Texas Instruments; Manufacturer Part Number 1: CD4043BDR; Voltage - Supply: 3 V ~ 18 V; Delay Time - Propagation: 50ns; Current - Output High, Low: 6.8mA, 6.8mA; Supplier 1: Digi-Key; Packaging: Cut Tape (CT); Part Status: Active; Circuit: 1:1; Output Type: Tri-State; Operating Temperature: -55°C ~ 125°C; Mounting Type: Surface Mount; Package / Case: 16-SOIC (0.154", 3.90mm Width); Supplier Device Package: 16-SOIC; ComponentLink1URL: http://www.ti.com/lit/ds/symlink/cd4043b.pdf; ComponentLink1Description: http://www.ti.com/lit/ds/symlink/cd4043b.pdf
U7 = IC COMPARATOR TLV1701 SOT-23-5: Comparator General Purpose Open Collector SOT-23-5; Manufacturer: Texas Instruments; Number of Channels: 1; Supplier 1: Digi-Key; Supplier Part Number 1: 296-47458-1-ND; Stock 1: 8944; Min Operating Temperature: -40°C; Max Operating Temperature: 125°C; ComponentLink1Description: Datasheet; ComponentLink1URL: http://www.ti.com/lit/ds/symlink/tlv1701-q1.pdf
U8 = IC AND GATE 1CH 5-SSOP: AND Gate IC 1 Channel 5-SSOP; Manufacturer 1: Rohm Semiconductor; Manufacturer Part Number 1: BU4S81G2-TR; Logic Level - Low: 1.5 V ~ 4 V; Logic Level - High: 3.5 V ~ 11 V; Number of Circuits: 1; Number of Inputs: 2; Voltage - Supply: 3 V ~ 16 V; Current - Quiescent (Max): 1µA; Current - Output High, Low: 3.4mA, 3.4mA; Max Propagation Delay @ V, Max CL: 30ns @ 15V, 50pF; Supplier 1: Digi-Key; Supplier Part Number 1: BU4S81G2CT-ND; Packaging: Cut Tape (CT); Part Status: Active; Operating Temperature: -40°C ~ 85°C; Mounting Type: Surface Mount; Supplier Device Package: 5-SSOP; Package / Case: SC-74A, SOT-753; ComponentLink1URL: http://rohmfs.rohm.com/en/products/databook/datasheet/ic/logic_switch/standard_logic/bu4s81g2-e.pdf; ComponentLink1Description: http://rohmfs.rohm.com/en/products/databook/datasheet/ic/logic_switch/standard_logic/bu4s81g2-e.pdf; Logic Type: AND Gate
U9 = IC DCDC ISOLATED 12V 1W 8-SMD 5-LEAD: Isolated Module DC DC Converter 1 Output 12V 84mA 10.8V - 13.2V Input; Manufacturer 1: XP Power; Manufacturer Part Number 1: ISE1212A; Number of Outputs: 1; Voltage - Isolation: 1.5kV (1500V); Efficiency: 81%; Supplier 1: Digi-Key; Supplier Part Number 1: 1470-2950-1-ND; Packaging: Cut Tape (CT); Part Status: Active; Voltage - Input (Min): 10.8V; Voltage - Input (Max): 13.2V; Voltage - Output 1: 12V; Voltage - Output 2: -; Voltage - Output 3: -; Current - Output (Max): 84mA; Operating Temperature: -40°C ~ 105°C; Mounting Type: Surface Mount; Package / Case: 8-SMD Module, 5 Leads; Size / Dimension: 0.50" L x 0.44" W x 0.29" H (12.7mm x 11.2mm x 7.3mm); ComponentLink1URL: http://www.xppower.com/Portals/0/pdfs/SF_ISE.pdf; ComponentLink1Description: http://www.xppower.com/Portals/0/pdfs/SF_ISE.pdf; Power: 1W

## Sheet Motor Interface - Fans.SchDoc
size A4
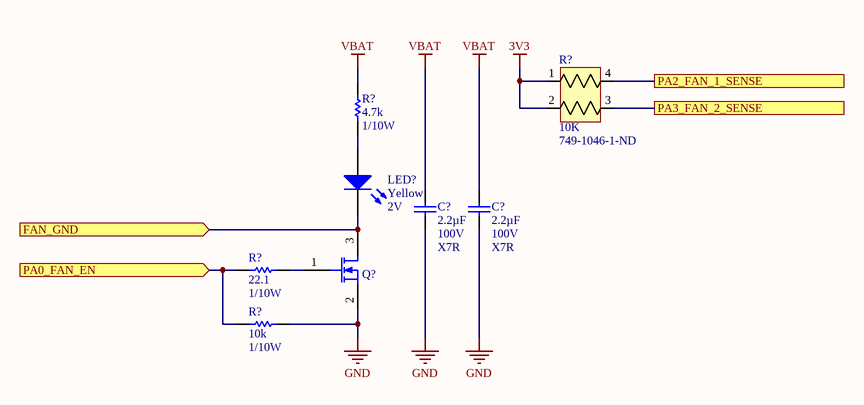
[diagram p6: Motor Interface - Fans.SchDoc]

### Parts
(Parts that share a designator on the sheet are numbered #1, #2 ... from top to bottom, then left to right.)
C?#1  Capacitance: 2.2µF  Voltage: 100V  Temperature Coefficient: X7R  [CAP, 1206]  (hidden comment: CAP CER 2.2UF 100V ±20% X7R 1206)
C?#2  Capacitance: 2.2µF  Voltage: 100V  Temperature Coefficient: X7R  [CAP, 1206]  (hidden comment: CAP CER 2.2UF 100V ±20% X7R 1206)
LED?  Color: Yellow  Voltage - Forward (Vf) (Typ): 2V  [LED_0603]  (hidden comment: LED YELLOW CLEAR 2.1V 0603)
Q?  MOSFET N-CH 30V 6.2A 0.9W SOT-23  [MOSFET N-CH 30V 6.2A 0.9W SOT-23]  (value not drawn)
R?#1  10K  Supplier Part Number 1: 749-1046-1-ND  [RES ARRAY 2 POS 0606]
R?#2  Resistance (Ohms): 4.7k  Power (Watts): 1/10W  [RES, 0603]  (hidden comment: RES 4.7K OHM 1% 1/10W 0603)
R?#3  Resistance: 22.1  Power: 1/10W  [RES, 0603]  (hidden comment: RES 22.1 OHM 1% 1/10W 0603)
R?#4  Resistance: 10k  Power: 1/10W  [RES, 0603]  (hidden comment: RES 10K OHM 1% 1/10W 0603)

### Ports
FAN_GND (in), PA0_FAN_EN (in), PA2_FAN_1_SENSE, PA3_FAN_2_SENSE

### Nets
3V3: R?#1.1 R?#1.2
GND: C?#1.2 C?#2.2 Q?.2(S) R?#4.2
VBAT: C?#1.1 C?#2.1 R?#2.1
FAN_GND: LED?.2(K) Q?.3(D) ; port FAN_GND
PA0_FAN_EN: R?#3.2 R?#4.1 ; port PA0_FAN_EN
PA2_FAN_1_SENSE: R?#1.4 ; port PA2_FAN_1_SENSE
PA3_FAN_2_SENSE: R?#1.3 ; port PA3_FAN_2_SENSE
NetLED?_1: LED?.1(A) R?#2.2
NetQ?_1: Q?.1(G) R?#3.1

### Library data of the parts
C?#1 C?#2 = CAP CER 2.2UF 100V ±20% X7R 1206: as C24 on sheet Motor Interface - Pre-Charge Logic; Supplier 1: Digi-Key; Supplier Part Number 1: 490-12773-1-ND; Packaging: Cut Tape (CT); Part Status: Active; Operating Temperature: -55°C ~ 125°C; Ratings: -; Mounting Type: Surface Mount, MLCC; Package / Case: 1206 (3216 Metric); Size / Dimension: 0.126" L x 0.063" W (3.20mm x 1.60mm); Height - Seated (Max): -; Thickness (Max): 0.071" (1.80mm); Lead Spacing: -; Lead Style: -; ComponentLink1URL: http://www.murata.com/~/media/webrenewal/support/library/catalog/products/capacitor/mlcc/c02e.ashx; ComponentLink1Description: http://www.murata.com/~/media/webrenewal/support/library/catalog/products/capacitor/mlcc/c02e.ashx; Tolerance: ±20%
LED? = LED YELLOW CLEAR 2.1V 0603: as LED4 on sheet Motor Interface - Pre-Charge Logic; Supplier 1: Digi-Key; RoHS: RoHS Compliant; Category: Optoelectronics; Stock 1: 10523; Pricing 1: 1=0.21, 100=0.1617, 500=0.13964 (CAD); Packaging: Cut Tape (CT); Part Status: Active; Lens Transparency: Clear; Mounting Type: Surface Mount; Wavelength - Dominant: 590nm; Features: -; Package / Case: 0603 (1608 Metric); Supplier Device Package: 0603; Size / Dimension: 1.60mm L x 0.80mm W; Height (Max): 0.80mm; ComponentLink1URL: http://katalog.we-online.de/led/datasheet/150060YS75000.pdf; ComponentLink1Description: http://katalog.we-online.de/led/datasheet/150060YS75000.pdf; Supplier Part Number 1: 732-4981-1-ND
Q? = MOSFET N-CH 30V 6.2A 0.9W SOT-23: N-Channel 30V 6.2A (Ta) 900mW (Ta) Surface Mount SOT-23; Manufacturer: Diodes; Manufacturer Part Number: DMN3023L-7; Rds On Max: 25mR; Input Capacitance: 873pF; Supplier 1: Digi-Key; Stock 1: 38246; Pricing 1: 1=0.47, 10=0.368, 100=0.2529, 500=0.1734, 1000=0.1301 (USD); Mount: Surface Mount; Case/Package: TO-236-3; Min Operating Temperature: -55°C; Max Operating Temperature: 150°C; Packaging: Tape and Reel; Drain to Source Voltage (Vdss): 30V; Continuous Drain Current (ID): 6.2A; Max Power Dissipation: 900mW; ComponentLink1URL: https://www.diodes.com/assets/Datasheets/DMN3023L.pdf; ComponentLink1Description: https://www.diodes.com/assets/Datasheets/DMN3023L.pdf; ComponentLink2URL: http://www.mouser.com/ds/2/115/DMN3023L-959533.pdf; ComponentLink2Description: http://www.mouser.com/ds/2/115/DMN3023L-959533.pdf; Supplier Part Number 1: DMN3023L-7DICT-ND
R?#1 = RES ARRAY 10K OHM 0.1% 2RES 0606: Manufacturer: Vishay Beyschlag; Manufacturer Part Number: ACASN1002S1002P1AT; Circuit Type: Isolated; Resistor Matching Ratio: ±0.05%; Resistor-Ratio-Drift: ±15 ppm/°C; Power Per Element: 125mW; Temperature Coefficient: ±25ppm/°C; Supplier 1: Digi-Key; RoHS: RoHS Compliant; Category: Resistors; Stock 1: 4541; Pricing 1: 1=0.84, 10=0.695, 25=0.5948, 50=0.5352, 100=0.466, 250=0.4164, 500=0.33712 (CAD); Packaging: Cut Tape (CT); Part Status: Active; Resistance (Ohms): 10k; Tolerance: ±0.1%; Operating Temperature: -55°C ~ 155°C; Applications: Automotive AEC-Q200, Voltage Divider (TCR Matched); Mounting Type: Surface Mount; Package / Case: 0606, Convex; Supplier Device Package: 0606; Size / Dimension: 0.063" L x 0.059" W (1.60mm x 1.50mm); Height - Seated (Max): 0.022" (0.55mm); ComponentLink1URL: http://www.vishay.com/docs/28770/acasat.pdf; ComponentLink1Description: http://www.vishay.com/docs/28770/acasat.pdf
R?#2 = RES 4.7K OHM 1% 1/10W 0603: 4.7k Ohm ±1% 0.1W, 1/10W Chip Resistor 0603 (1608 Metric) Moisture Resistant Thick Film; Manufacturer 1: Yageo; Manufacturer Part Number 1: RC0603FR-074K7L; Description 1: RES SMD 4.7K OHM 1% 1/10W 0603; Temperature Coefficient: ±100ppm/°C; Supplier 1: Digi-Key; Supplier Part Number 1: 311-4.70KHRCT-ND; RoHS: RoHS Compliant; Category: Resistors; Stock 1: 3487566; Pricing 1: 1=0.16, 10=0.022, 100=0.0089, 1000=0.00402, 2500=0.00349 (CAD); Packaging: Cut Tape (CT); Part Status: Active; Composition: Thick Film; Features: Moisture Resistant; Operating Temperature: -55°C ~ 155°C; Package / Case: 0603 (1608 Metric); Supplier Device Package: 0603; Size / Dimension: 0.063" L x 0.031" W (1.60mm x 0.80mm); Height - Seated (Max): 0.022" (0.55mm); Failure Rate: -; ComponentLink1URL: http://www.yageo.com/documents/recent/PYu-RC_Group_51_RoHS_L_7.pdf; ComponentLink1Description: http://www.yageo.com/documents/recent/PYu-RC_Group_51_RoHS_L_7.pdf; Tolerance: ±1%
R?#3 = RES 22.1 OHM 1% 1/10W 0603: as R25 on sheet Motor Interface - Pre-Charge Logic; Supplier 1: Digi-Key; Supplier Part Number 1: 311-22.1HRCT-ND; Packaging: Cut Tape (CT); Part Status: Active; Composition: Thick Film; Operating Temperature: -55°C ~ 155°C; Package / Case: 0603 (1608 Metric); Supplier Device Package: 0603; Size / Dimension: 0.063" L x 0.031" W (1.60mm x 0.80mm); Height - Seated (Max): 0.022" (0.55mm); Failure Rate: -; ComponentLink1URL: http://www.yageo.com/documents/recent/PYu-RC_Group_51_RoHS_L_7.pdf; ComponentLink1Description: http://www.yageo.com/documents/recent/PYu-RC_Group_51_RoHS_L_7.pdf; Tolerance: ±1%
R?#4 = RES 10K OHM 1% 1/10W 0603: as R24 on sheet Motor Interface - Pre-Charge Logic; Supplier 1: Digi-Key; Supplier Part Number 1: 311-10.0KHRCT-ND; Packaging: Cut Tape (CT); Part Status: Active; Composition: Thick Film; Operating Temperature: -55°C ~ 155°C; Package / Case: 0603 (1608 Metric); Supplier Device Package: 0603; Size / Dimension: 0.063" L x 0.031" W (1.60mm x 0.80mm); Height - Seated (Max): 0.022" (0.55mm); Failure Rate: -; ComponentLink1URL: http://www.yageo.com/documents/recent/PYu-RC_Group_51_RoHS_L_7.pdf; ComponentLink1Description: http://www.yageo.com/documents/recent/PYu-RC_Group_51_RoHS_L_7.pdf; Tolerance: ±1%

## Nets that join several sheets
3V3: Motor Interface - CAN (7 pins), Motor Interface - Pre-Charge Interface (C7.1 C8.1 U3.3), Motor Interface - Connectors (7 pins)
GND: Motor Interface - CAN (8 pins), Motor Interface - Pre-Charge Interface (8 pins), Motor Interface - Connectors (20 pins), Motor Interface - Pre-Charge Logic (10 pins)
HV_IN: Motor Interface - Pre-Charge HV (F1.1), Motor Interface - Connectors (D11.1 P4.4)
ISO_12V: Motor Interface - Pre-Charge HV (C11.2 R16.1 U4.8), Motor Interface - Pre-Charge Logic (12 pins)
ISO_GND: Motor Interface - Pre-Charge HV (13 pins), Motor Interface - Connectors (D10.2 D11.2 P4.3), Motor Interface - Pre-Charge Logic (23 pins)
VBAT: Motor Interface - Pre-Charge Interface (U3.1 U3.9), Motor Interface - Connectors (9 pins)
VBAT_PRECHARGE_SW: Motor Interface - Pre-Charge Interface (R3.1 U3.7 U3.8), Motor Interface - Connectors (7 pins), Motor Interface - Pre-Charge Logic (9 pins)
CONTACTOR_SENSE_IN: Motor Interface - Pre-Charge Interface (C9.1 R5.1 R36.2), Motor Interface - Connectors (P6.3)
IN+: Motor Interface - Pre-Charge HV (D7.2 R12.2 R18.1), Motor Interface - Pre-Charge Logic (5 pins)
IN-: Motor Interface - Pre-Charge HV (D6.2 R11.2 R17.1), Motor Interface - Pre-Charge Logic (C19.2 IN-1.TP U7.3)
ISO_LATCH_OUT: Motor Interface - Pre-Charge HV (D12.1), Motor Interface - Pre-Charge Logic (6 pins)
MOTOR_CONTROLLER_CAN_N: Motor Interface - CAN (U2.6), Motor Interface - Connectors (D2.1 D3.1 P3.4 P5.4)
MOTOR_CONTROLLER_CAN_P: Motor Interface - CAN (U2.7), Motor Interface - Connectors (D2.2 D3.2 P3.3 P5.3)
MOTOR_CONTROLLER_HV: Motor Interface - Pre-Charge HV (D5.1 F2.1), Motor Interface - Connectors (D10.1 P4.1)
PA8_nCAN_INTERRUPT: Motor Interface - CAN (TP6.TP U1.13), Motor Interface - Connectors (P2.7)
PA9_PRECHARGE_EN: Motor Interface - Pre-Charge Interface (R4.1 U3.2), Motor Interface - Connectors (P2.6)
PA10_CONTACTOR_MONITOR: Motor Interface - Pre-Charge Interface (C27.1 R36.1), Motor Interface - Connectors (P2.5)
PB0: Motor Interface - Connectors (P2.17), Motor Interface - Pre-Charge Logic (LATCH_OUT.TP R25.1 U5.7)
PB10_nRX0BF: Motor Interface - CAN (U1.12), Motor Interface - Connectors (P2.14)
PB11_nRX1BF: Motor Interface - CAN (U1.11), Motor Interface - Connectors (P2.13)
PB12_SPI2_NSS: Motor Interface - CAN (TP5.TP U1.18), Motor Interface - Connectors (P2.11)
PB13_SPI2_SCK: Motor Interface - CAN (TP2.TP U1.14), Motor Interface - Connectors (P2.10)
PB14_SPI2_MISO: Motor Interface - CAN (TP4.TP U1.17), Motor Interface - Connectors (P2.9)
PB15_SPI2_MOSI: Motor Interface - CAN (TP3.TP U1.16), Motor Interface - Connectors (P2.8)

## Assembly variants
01 - Standard: not fitted C?